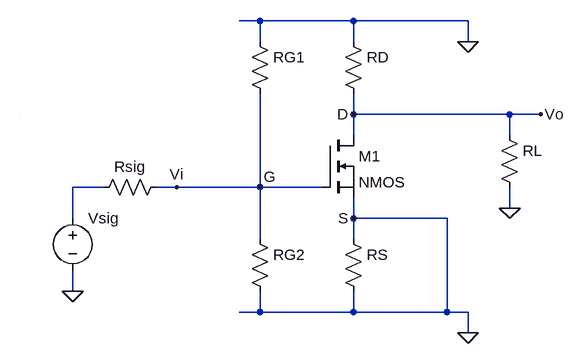
[diagram p0: schematic nmos_AC.asc]
nmos_AC.asc, the LTspice schematic file:
Version 4
SHEET 1 880 680
WIRE 368 -144 336 -144
WIRE 512 -144 368 -144
WIRE 688 -144 512 -144
WIRE 368 -112 368 -144
WIRE 512 -112 512 -144
WIRE 688 -112 688 -144
WIRE 512 0 512 -32
WIRE 752 0 512 0
WIRE 800 0 752 0
WIRE 512 32 512 0
WIRE 752 32 752 0
WIRE 128 112 80 112
WIRE 240 112 208 112
WIRE 368 112 368 -32
WIRE 368 112 240 112
WIRE 464 112 368 112
WIRE 752 144 752 112
WIRE 80 160 80 112
WIRE 512 160 512 128
WIRE 656 160 512 160
WIRE 368 192 368 112
WIRE 512 192 512 160
WIRE 80 272 80 240
WIRE 368 304 368 272
WIRE 368 304 336 304
WIRE 512 304 512 272
WIRE 512 304 368 304
WIRE 656 304 656 160
WIRE 656 304 512 304
WIRE 688 304 656 304
WIRE 688 336 688 304
WIRE 0 0 0 0
FLAG 80 272 0
FLAG 240 112 Vi
FLAG 688 336 0
FLAG 368 112 G
FLAG 512 0 D
FLAG 512 160 S
FLAG 752 144 0
FLAG 800 0 Vo
FLAG 688 -112 0
SYMBOL voltage 80 144 R0
WINDOW 3 24 96 Invisible 2
SYMATTR InstName Vsig
SYMBOL res 224 96 R90
WINDOW 0 0 56 VBottom 2
WINDOW 3 32 56 Invisible 2
SYMATTR InstName Rsig
SYMBOL res 352 176 R0
WINDOW 3 36 76 Invisible 2
SYMATTR InstName RG2
SYMBOL res 352 -128 R0
WINDOW 3 36 76 Invisible 2
SYMATTR InstName RG1
SYMBOL nmos 464 32 R0
SYMATTR InstName M1
SYMBOL res 496 -128 R0
WINDOW 3 36 76 Invisible 2
SYMATTR InstName RD
SYMBOL res 496 176 R0
WINDOW 3 36 76 Invisible 2
SYMATTR InstName RS
SYMBOL res 736 16 R0
WINDOW 3 36 76 Invisible 2
SYMATTR InstName RL

The netlist it stands for:
* nmos_AC.asc
Vsig N001 0 V
Rsig G N001 R
RG2 G 0 R
RG1 0 G R
M1 Vo G 0 0 NMOS
RD 0 Vo R
RS 0 0 R
RL Vo 0 R
.model NMOS NMOS
.model PMOS PMOS
.lib standard.mos
.backanno
.end